# EAGLE schematic 1port (EAGLE 7.6.0)
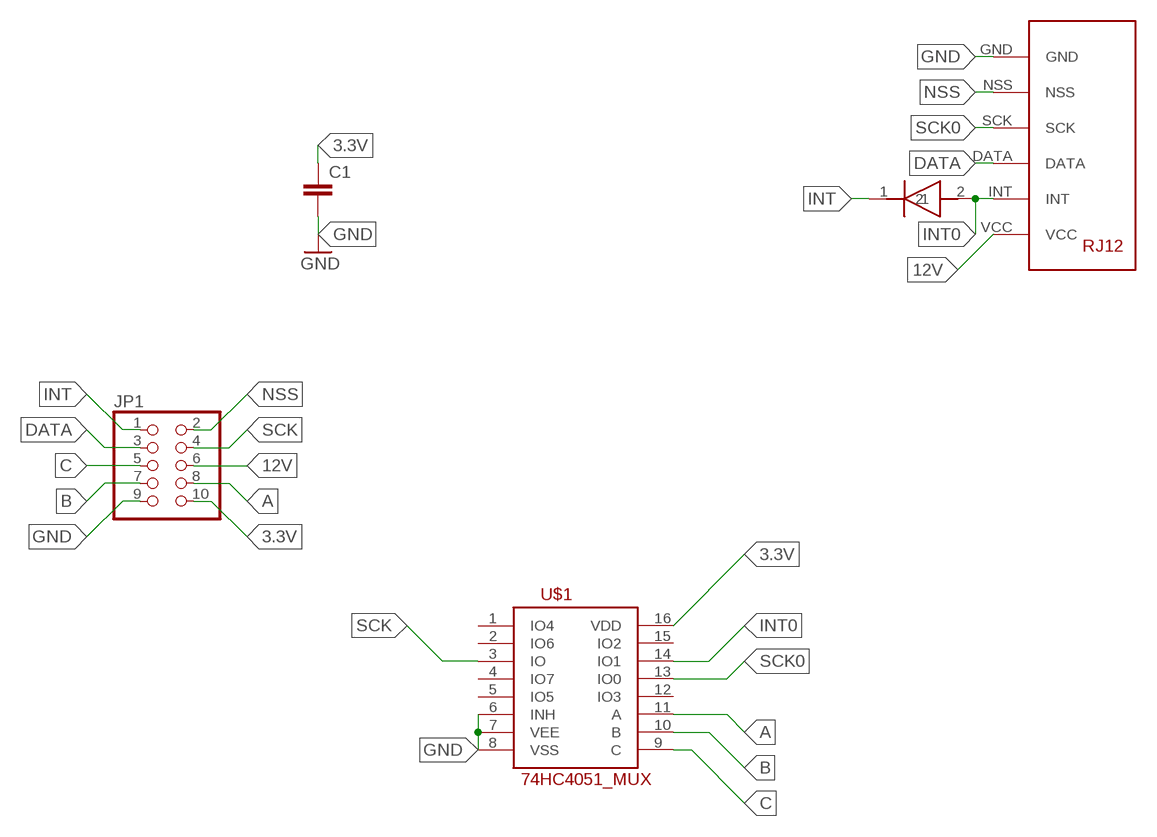
[diagram p0: schematic, sheet 1]

## Parts
C1  C-EUC1206  [C1206]
JP1  PINHD-2X5  [2X05]
U$1  74HC4051_MUX  [SO16]
U$4  RJ12SMD  [RJ12_SMD]
U$9  DIODE  [DIL_DIODE_SMD]

## Nets
3.3V: C1.1 JP1.10 U$1.16(VDD)
12V: JP1.6 U$4.VCC
A: JP1.8 U$1.11(A)
B: JP1.7 U$1.10(B)
C: JP1.5 U$1.9(C)
DATA: JP1.3 U$4.DATA
GND: C1.2 JP1.9 U$1.6(INH) U$1.7(VEE) U$1.8(VSS) U$4.GND
INT: JP1.1 U$9.1
INT0: U$1.14(IO1) U$4.INT U$9.2
NSS: JP1.2 U$4.NSS
SCK: JP1.4 U$1.3(IO)
SCK0: U$1.13(IO0) U$4.SCK
Unconnected: U$1.1(IO4) U$1.2(IO6) U$1.4(IO7) U$1.5(IO5) U$1.12(IO3) U$1.15(IO2)

## Library data of the parts
C1 = resistor:C-EU: CAPACITOR, European symbol
JP1 = pinhead:PINHD-2X5: PIN HEADER
U$1 = SparkFun-AnalogIC:74HC4051_MUX: 8:1 analog mux
U$4 = gumyns:RJ12
U$9 = gumyns:DIODE